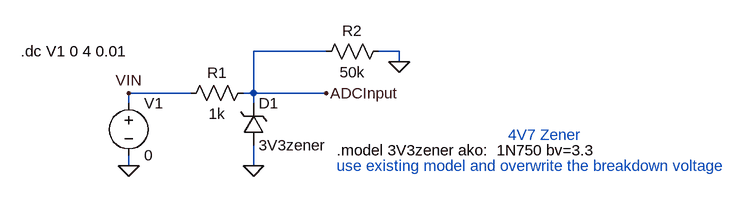
[diagram p0: schematic ADC_InputProtection.asc]
ADC_InputProtection.asc, the LTspice schematic file:
Version 4
SHEET 1 936 680
WIRE 256 -272 144 -272
WIRE 368 -272 336 -272
WIRE 368 -256 368 -272
WIRE 48 -208 -48 -208
WIRE 144 -208 144 -272
WIRE 144 -208 128 -208
WIRE 256 -208 144 -208
WIRE -48 -192 -48 -208
WIRE 144 -192 144 -208
WIRE -48 -96 -48 -112
WIRE 144 -96 144 -128
FLAG 144 -96 0
FLAG -48 -96 0
FLAG 256 -208 ADCInput
FLAG -48 -208 VIN
FLAG 368 -256 0
SYMBOL res 144 -224 R90
WINDOW 0 0 56 VBottom 2
WINDOW 3 32 56 VTop 2
SYMATTR InstName R1
SYMATTR Value 1k
SYMBOL zener 128 -128 M180
WINDOW 0 24 64 Left 2
WINDOW 3 24 0 Left 2
SYMATTR InstName D1
SYMATTR Value 3V3zener
SYMATTR Description Diode
SYMATTR Type diode
SYMBOL voltage -48 -208 R0
SYMATTR InstName V1
SYMATTR Value 0
SYMBOL res 352 -288 R90
WINDOW 0 0 56 VBottom 2
WINDOW 3 32 56 VTop 2
SYMATTR InstName R2
SYMATTR Value 50k
TEXT 536 -144 Left 2 ;4V7 Zener
TEXT -214 -272 Left 2 !.dc V1 0 4 0.01
TEXT 272 -120 Left 2 !.model 3V3zener ako:  1N750 bv=3.3
TEXT 272 -96 Left 2 ;use existing model and overwrite the breakdown voltage

The netlist it stands for:
* ADC_InputProtection.asc
R1 ADCInput VIN 1k
D1 0 ADCInput 3V3zener
V1 VIN 0 0
R2 0 ADCInput 50k
.model D D
.lib standard.dio
* 4V7 Zener
.dc V1 0 4 0.01
.model 3V3zener ako:  1N750 bv=3.3
* use existing model and overwrite the breakdown voltage
.backanno
.end